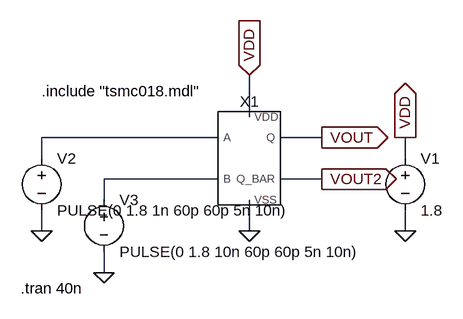
[diagram p0: schematic test_cmos_or.asc]
test_cmos_or.asc, the LTspice schematic file:
Version 4
SHEET 1 1348 680
WIRE 128 112 128 48
WIRE 80 144 -192 144
WIRE 240 144 176 144
WIRE -192 176 -192 144
WIRE 368 176 368 144
WIRE 80 208 -96 208
WIRE 240 208 176 208
WIRE -96 240 -96 208
WIRE -192 288 -192 256
WIRE 128 288 128 240
WIRE 368 288 368 256
WIRE -96 352 -96 320
FLAG 128 48 VDD
IOPIN 128 48 In
FLAG 128 288 0
FLAG 240 144 VOUT
IOPIN 240 144 Out
FLAG 368 144 VDD
IOPIN 368 144 Out
FLAG 368 288 0
FLAG -192 288 0
FLAG -96 352 0
FLAG 240 208 VOUT2
IOPIN 240 208 Out
SYMBOL voltage 368 160 R0
WINDOW 123 0 0 Left 0
WINDOW 39 0 0 Left 0
SYMATTR InstName V1
SYMATTR Value 1.8
SYMBOL voltage -192 160 R0
SYMATTR InstName V2
SYMATTR Value PULSE(0 1.8 1n 60p 60p 5n 10n)
SYMBOL voltage -96 224 R0
WINDOW 123 0 0 Left 0
WINDOW 39 0 0 Left 0
SYMATTR InstName V3
SYMATTR Value PULSE(0 1.8 10n 60p 60p 5n 10n)
SYMBOL my_cmos_or 128 176 R0
SYMATTR InstName X1
TEXT -224 376 Left 2 !.tran 40n
TEXT -192 72 Left 2 !.include "tsmc018.mdl"

The netlist it stands for:
* test_cmos_or.asc
V1 VDD 0 1.8
V2 N001 0 PULSE(0 1.8 1n 60p 60p 5n 10n)
V3 N002 0 PULSE(0 1.8 10n 60p 60p 5n 10n)
XX1 N001 N002 VDD 0 VOUT VOUT2 my_cmos_or  ; pins A B VDD VSS Q Q_BAR
.tran 40n
.include "tsmc018.mdl"
.backanno
.end